# EAGLE design reLoaD_Motor (EAGLE 9.7.0)
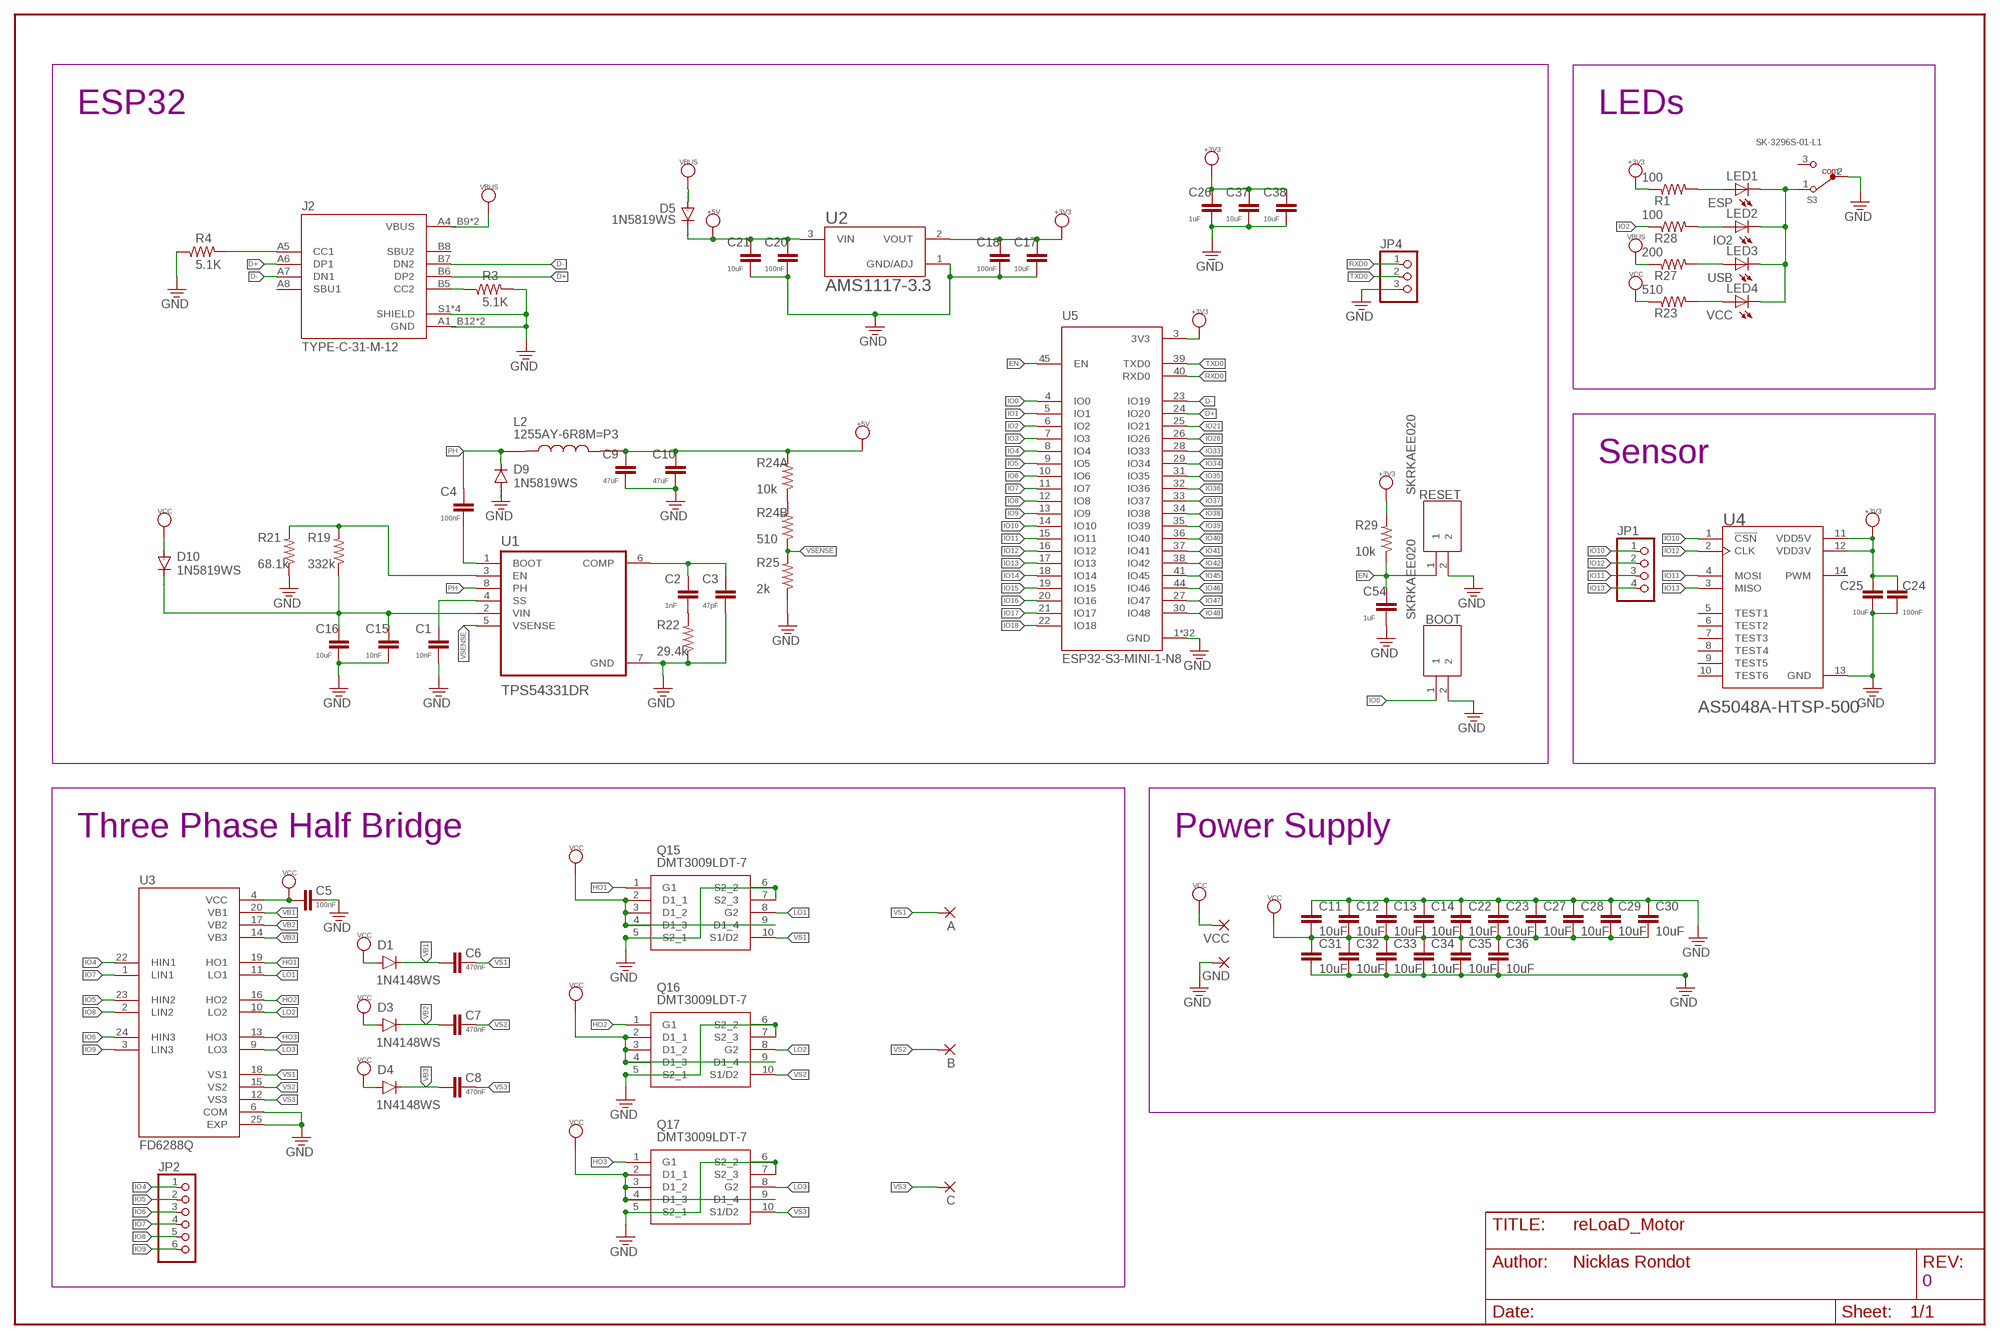
[diagram p0: schematic, sheet 1]

## Parts
A  3,81/1,4  [3,81/1,4]
B  3,81/1,4  [3,81/1,4]
BOOT  SKRKAEE020  [SKRKAEE020]
C  3,81/1,4  [3,81/1,4]
C1  10nF  C-EUC0603K  [C0603K]
C2  1nF  C-EUC0603K  [C0603K]
C3  47pF  C-EUC0603K  [C0603K]
C4  100nF  C-EUC0603K  [C0603K]
C5  100nF  C-EUC0603K  [C0603K]
C6  470nF  C-EUC0603K  [C0603K]
C7  470nF  C-EUC0603K  [C0603K]
C8  470nF  C-EUC0603K  [C0603K]
C9  47uF  C-EUC0603K  [C0603K]
C10  47uF  C-EUC0603K  [C0603K]
C11  10uF  C-EUC0805K  [C0805K]
C12  10uF  C-EUC0805K  [C0805K]
C13  10uF  C-EUC0805K  [C0805K]
C14  10uF  C-EUC0805K  [C0805K]
C15  10nF  C-EUC0603K  [C0603K]
C16  10uF  C-EUC0603K  [C0603K]
C17  10uF  C-EUC0603K  [C0603K]
C18  100nF  C-EUC0603K  [C0603K]
C20  100nF  C-EUC0603K  [C0603K]
C21  10uF  C-EUC0603K  [C0603K]
C22  10uF  C-EUC0805K  [C0805K]
C23  10uF  C-EUC0805K  [C0805K]
C24  100nF  C-EUC0603K  [C0603K]
C25  10uF  C-EUC0603K  [C0603K]
C26  1uF  C-EUC0603K  [C0603K]
C27  10uF  C-EUC0805K  [C0805K]
C28  10uF  C-EUC0805K  [C0805K]
C29  10uF  C-EUC0805K  [C0805K]
C30  10uF  C-EUC0805K  [C0805K]
C31  10uF  C-EUC0805K  [C0805K]
C32  10uF  C-EUC0805K  [C0805K]
C33  10uF  C-EUC0805K  [C0805K]
C34  10uF  C-EUC0805K  [C0805K]
C35  10uF  C-EUC0805K  [C0805K]
C36  10uF  C-EUC0805K  [C0805K]
C37  10uF  C-EUC0603K  [C0603K]
C38  10uF  C-EUC0603K  [C0603K]
C54  1uF  C-EUC0603K  [C0603K]
D1  1N4148WS  [SOD-323]
D3  1N4148WS  [SOD-323]
D4  1N4148WS  [SOD-323]
D5  1N5819WS  DIODE-SOD323-W  [SOD323-W]
D9  1N5819WS  DIODE-SOD323-W  [SOD323-W]
D10  1N5819WS  DIODE-SOD323-W  [SOD323-W]
GND  3,81/1,4  [3,81/1,4]
J2  TYPE-C-31-M-12  [HRO_TYPE-C-31-M-12]
JP1  PINHD-1X4  [1X04]
JP2  PINHD-1X6  [1X06]
JP4  PINHD-1X3  [1X03]
L2  1255AY-6R8M=P3  [IND_1255AY-6R8M=P3]
LED1  ESP  LEDCHIPLED_0805  [CHIPLED_0805]
LED2  IO2  LEDCHIPLED_0805  [CHIPLED_0805]
LED3  USB  LEDCHIPLED_0805  [CHIPLED_0805]
LED4  VCC  LEDCHIPLED_0805  [CHIPLED_0805]
Q15  DMT3009LDT-7  [DMT3009LDT7]
Q16  DMT3009LDT-7  [DMT3009LDT7]
Q17  DMT3009LDT-7  [DMT3009LDT7]
R1  100  R-US_R0603  [R0603]
R3  5.1K  R-US_R0603  [R0603]
R4  5.1K  R-US_R0603  [R0603]
R19  332k  R-US_R0603  [R0603]
R21  68.1k  R-US_R0603  [R0603]
R22  29.4k  R-US_R0603  [R0603]
R23  510  R-US_R0603  [R0603]
R24A  10k  R-US_R0603  [R0603]
R24B  510  R-US_R0603  [R0603]
R25  2k  R-US_R0603  [R0603]
R27  200  R-US_R0603  [R0603]
R28  100  R-US_R0603  [R0603]
R29  10k  R-US_R0603  [R0603]
RESET  SKRKAEE020  [SKRKAEE020]
S3  SK-3296S-01-L1  450404015514  [450404015514]
U1  TPS54331DR  [SOIC127P599X175-8N]
U2  AMS1117-3.3  [SOT229P700X180-4N]
U3  FD6288Q  [QFN50P400X400X90-25N]
U4  AS5048A-HTSP-500  [SOP65P640X120-14N]
U5  ESP32-S3-MINI-1-N8  [XCVR_ESP32-S3-MINI-1-N8]
VCC  3,81/1,4  [3,81/1,4]

## Nets
+3V3: C17.1 C18.1 C24.2 C25.2 C26.1 C37.1 C38.1 R1.1 R29.2 U2.2(VOUT) U4.11(VDD5V) U4.12(VDD3V) U5.3(3V3)
+5V: C9.1 C10.1 C20.1 C21.1 D5.C L2.2 R24A.2 U2.3(VIN)
D+: J2.A6(DP1) J2.B6(DP2) U5.24(IO20)
D-: J2.A7(DN1) J2.B7(DN2) U5.23(IO19)
EN: C54.1 R29.1 RESET.1 U5.45(EN)
GND: BOOT.2 C1.2 C3.2 C5.1 C9.2 C10.2 C11.1 C12.1 C13.1 C14.1 C15.2 C16.2 C17.2 C18.2 C20.2 C21.2 C22.1 C23.1 C24.1 C25.1 C26.2 C27.1 C28.1 C29.1 C30.1 C31.2 C32.2 C33.2 C34.2 C35.2 C36.2 C37.2 C38.2 C54.2 D9.A GND.1(P) J2.A1_B12(GND) J2.B1_A12(GND) J2.S1(SHIELD) J2.S2(SHIELD) J2.S3(SHIELD) J2.S4(SHIELD) JP4.3 Q15.5(S2_1) Q15.6(S2_2) Q15.7(S2_3) Q16.5(S2_1) Q16.6(S2_2) Q16.7(S2_3) Q17.5(S2_1) Q17.6(S2_2) Q17.7(S2_3) R3.2 R4.1 R21.1 R22.1 R25.1 RESET.2 S3.2 U1.7(GND) U2.1(GND/ADJ) U3.6(COM) U3.25(EXP) U4.13(GND) U5.1(GND) U5.2(GND) U5.42(GND) U5.43(GND) U5.46(GND) U5.47(GND) U5.48(GND) U5.49(GND) U5.50(GND) U5.51(GND) U5.52(GND) U5.53(GND) U5.54(GND) U5.55(GND) U5.56(GND) U5.57(GND) U5.58(GND) U5.59(GND) U5.60(GND) U5.61(GND) U5.61_1(GND) U5.61_2(GND) U5.61_3(GND) U5.61_4(GND) U5.61_5(GND) U5.61_6(GND) U5.61_7(GND) U5.61_8(GND) U5.62(GND) U5.63(GND) U5.64(GND) U5.65(GND)
HO1: Q15.1(G1) U3.19(HO1)
HO2: Q16.1(G1) U3.16(HO2)
HO3: Q17.1(G1) U3.13(HO3)
IO0: BOOT.1 U5.4(IO0)
IO1: U5.5(IO1)
IO2: R28.1 U5.6(IO2)
IO3: U5.7(IO3)
IO4: JP2.1 U3.22(HIN1) U5.8(IO4)
IO5: JP2.2 U3.23(HIN2) U5.9(IO5)
IO6: JP2.3 U3.24(HIN3) U5.10(IO6)
IO7: JP2.4 U3.1(LIN1) U5.11(IO7)
IO8: JP2.5 U3.2(LIN2) U5.12(IO8)
IO9: JP2.6 U3.3(LIN3) U5.13(IO9)
IO10: JP1.1 U4.1(!CSN) U5.14(IO10)
IO11: JP1.3 U4.4(MOSI) U5.15(IO11)
IO12: JP1.2 U4.2(CLK) U5.16(IO12)
IO13: JP1.4 U4.3(MISO) U5.17(IO13)
IO14: U5.18(IO14)
IO15: U5.19(IO15)
IO16: U5.20(IO16)
IO17: U5.21(IO17)
IO18: U5.22(IO18)
IO21: U5.25(IO21)
IO26: U5.26(IO26)
IO33: U5.28(IO33)
IO34: U5.29(IO34)
IO35: U5.31(IO35)
IO36: U5.32(IO36)
IO37: U5.33(IO37)
IO38: U5.34(IO38)
IO39: U5.35(IO39)
IO40: U5.36(IO40)
IO41: U5.37(IO41)
IO42: U5.38(IO42)
IO45: U5.41(IO45)
IO46: U5.44(IO46)
IO47: U5.27(IO47)
IO48: U5.30(IO48)
LO1: Q15.8(G2) U3.11(LO1)
LO2: Q16.8(G2) U3.10(LO2)
LO3: Q17.8(G2) U3.9(LO3)
N$1: LED3.A R27.2
N$2: LED4.A R23.2
N$3: LED1.A R1.2
N$4: J2.B5(CC2) R3.1
N$5: LED1.C LED2.C LED3.C LED4.C S3.1
N$6: LED2.A R28.2
N$7: R19.2 R21.2 U1.3(EN)
N$8: C1.1 U1.4(SS)
N$9: R24A.1 R24B.2
N$10: C2.1 C3.1 U1.6(COMP)
N$11: C2.2 R22.2
N$30: C4.2 U1.1(BOOT)
N$35: C15.1 C16.1 D10.C R19.1 U1.2(VIN)
N$80: J2.A5(CC1) R4.2
PH: C4.1 D9.C L2.1 U1.8(PH)
RXD0: JP4.1 U5.40(RXD0)
TXD0: JP4.2 U5.39(TXD0)
VB1: C6.1 D1.C U3.20(VB1)
VB2: C7.1 D3.C U3.17(VB2)
VB3: C8.1 D4.C U3.14(VB3)
VBUS: D5.A J2.A4_B9(VBUS) J2.B4_A9(VBUS) R27.1
VCC: C5.2 C11.2 C12.2 C13.2 C14.2 C22.2 C23.2 C27.2 C28.2 C29.2 C30.2 C31.1 C32.1 C33.1 C34.1 C35.1 C36.1 D1.A D3.A D4.A D10.A Q15.2(D1_1) Q15.3(D1_2) Q15.4(D1_3) Q15.9(D1_4) Q16.2(D1_1) Q16.3(D1_2) Q16.4(D1_3) Q16.9(D1_4) Q17.2(D1_1) Q17.3(D1_2) Q17.4(D1_3) Q17.9(D1_4) R23.1 U3.4(VCC) VCC.1(P)
VS1: A.1(P) C6.2 Q15.10(S1/D2) U3.18(VS1)
VS2: B.1(P) C7.2 Q16.10(S1/D2) U3.15(VS2)
VS3: C8.2 C.1(P) Q17.10(S1/D2) U3.12(VS3)
VSENSE: R24B.1 R25.2 U1.5(VSENSE)
Unconnected: J2.A8(SBU1) J2.B8(SBU2) S3.3 U4.5(TEST1) U4.6(TEST2) U4.7(TEST3) U4.8(TEST4) U4.9(TEST5) U4.10(TEST6) U4.14(PWM)

## Notes on the sheet
- ESP32 | LEDs
- Sensor
- Three Phase Half Bridge | Power Supply
- 0

## Library data of the parts
A B C GND VCC = wirepad:3,81/1,4: THROUGH-HOLE PAD
BOOT RESET = SKRKAEE020:SKRKAEE020: Tactile Switches 3.9x2.9x2.0mm 160gf Packaging Temp 80oC Source: Datasheet; DESCRIPTION: Tactile Switches 3.9x2.9x2.0mm 160gf Packaging Temp 80oC; HEIGHT: 2mm; MANUFACTURER_NAME: ALPS Electric; MANUFACTURER_PART_NUMBER: SKRKAEE020; MOUSER_PART_NUMBER: 688-SKRKAEE020; MOUSER_PRICE-STOCK: https://www.mouser.co.uk/ProductDetail/Alps-Alpine/SKRKAEE020?qs=MrosSN5%252BUQW89XjXIp8Ugw%3D%3D
C1-C10 C15-C18 C20 C21 C24-C26 C37 C38 C54 = resistor:C-EU: CAPACITOR, European symbol
C11-C14 C22 C23 C27-C36 = rcl:C-EU: CAPACITOR, European symbol; SPICEPREFIX: C
D1 D3 D4 = Diodes-2:1N4148WS: DIODE GEN PURP 75V 150MA SOD323F Manufacturer's datasheet; CREATED_BY: PCBLayout.com; DIGIKEY_PART_NUMBER: 1N4148WSFSTR-ND; MANUFACTURER: Diodes Incorporated; MPN: 1N4148WS; PACKAGE: SOD-323
D5 D9 D10 = diode:DIODE-: DIODE
J2 = TYPE-C-31-M-12:TYPE-C-31-M-12: Check availability; AVAILABILITY: Not in stock; DESCRIPTION: USB Connectors 24 Receptacle 1 8.94*7.3mm RoHS; MF: HRO Electronics Co., Ltd.; MP: TYPE-C-31-M-12; PACKAGE: Package; PRICE: None
JP1 = DC_LOAD_AU:PINHD-1X4: PIN HEADER
JP2 = pinhead:PINHD-1X6: PIN HEADER
JP4 = pinhead:PINHD-1X3: PIN HEADER
L2 = 1255AY-6R8M=P3:1255AY-6R8M=P3: 3.9µH Shielded Wirewound Inductor 4.2A 26.4mOhm Max Nonstandard Check availability; AVAILABILITY: Not in stock; CHECK_PRICES: https://www.snapeda.com/parts/1255AY-6R8M=P3/Murata+Electronics+North+America/view-part/?ref=eda; DESCRIPTION: 6.8 µH Shielded Drum Core, Wirewound Inductor 3.4 A 36mOhm Nonstandard; MF: Murata Electronics; MP: 1255AY-6R8M=P3; PACKAGE: NONSTANDARD; PRICE: None; PURCHASE-URL: https://www.snapeda.com/api/url_track_click_mouser/?unipart_id=1508412&manufacturer=Murata Electronics&part_name=1255AY-6R8M=P3&search_term=1255ay-6r8m=p3; SNAPEDA_LINK: https://www.snapeda.com/parts/1255AY-6R8M=P3/Murata+Electronics+North+America/view-part/?ref=snap
LED1-LED4 = adafruit:LED: LED OSRAM: - CHIPLED LG R971, LG N971, LY N971, LG Q971, LY Q971, LO R971, LY R971 LH N974, LH R974 LS Q976, LO Q976, LY Q976 LO Q996 - Hyper CHIPLED LW Q18S LB Q993, LB Q99A, LB R99A - SideLED LS A670, LO A670, LY A670, LG A670, LP A670 LB A673, LV A673, LT A673, LW A673 LH A674 LY A675 LS A676, LA A676, LO A676, LY A676, LW A676 LS A679, LY A679, LG A679 - Hyper Micro SIDELED® LS Y876, LA Y876, LO Y876, LY Y876 LT Y87S - SmartLED LW L88C, LW L88S LB L89C, LB L89S, LG L890 LS L89K, LO L89K, LY L89K LS L896, LA L896, LO L896, LY L896 - TOPLED LS T670, LO T670, LY T670, LG T670, LP T670 LSG T670, LSP T670, LSY T670, LOP T670, LYG T670 LG T671, LOG T671, LSG T671 LB T673, LV T673, LT T673, LW T673 LH T674 LS T676, LA T676, LO T676, LY T676, LB T676, LH T676, LSB T676, LW T676 LB T67C, LV T67C, LT T67C, LS T67K, LO T67K, LY T67K, LW E67C LS E67B, LA E67B, LO E67B, LY E67B, LB E67C, LV E67C, LT E67C LW T67C LS T679, LY T679, LG T679 LS T770, LO T770, LY T770, LG T770, LP T770 LB T773, LV T773, LT T773, LW T773 LH T774 LS E675, LA E675, LY E675, LS T675 LS T776, LA T776, LO T776, LY T776, LB T776 LHGB T686 LT T68C, LB T68C - Hyper Mini TOPLED® LB M676 - Mini TOPLED Santana® LG M470 LS M47K, LO M47K, LY M47K Source: http://www.osram.convergy.de/
Q15-Q17 = DMT3009LDT-7:DMT3009LDT-7: Trans MOSFET N-CH 30V 30A 8-Pin VDFN T/R Source: Datasheet; DESCRIPTION: Trans MOSFET N-CH 30V 30A 8-Pin VDFN T/R; HEIGHT: 0.85mm; MANUFACTURER_NAME: Diodes Incorporated; MANUFACTURER_PART_NUMBER: DMT3009LDT-7; MOUSER_PART_NUMBER: 621-DMT3009LDT-7; MOUSER_PRICE-STOCK: https://www.mouser.co.uk/ProductDetail/Diodes-Incorporated/DMT3009LDT-7?qs=60RJRzIpcl%2Fbs7PsZRGw9g%3D%3D
R1 R3 R4 R19 R21-R23 R24A R24B R25 R27-R29 = resistor:R-US_: RESISTOR, American symbol
S3 = Wurth_Switch_WS-SLSU:450404015514: WS-SLSU Mini Slide Switch, Same Side Connection Side Push 6.7x2.7 mm Properties Actuator Material:PA46 Actuator Flammability Rating:UL94 HB Actuator Color:Black Frame Material:LCP Frame Flammability Rating:UL94 V-0 Frame Color:Black Contact Material:Copper Alloy Contact Plating:Silver Terminal Material:Copper Alloy Terminal Plating:Silver Switching Function:On-On Schematic:SPDT Connection Type:Same Side Connection Qty.:3300 Material Properties Cover Material:Stainless Steel General Information Operating Temperature:-40 up to +85 °C Packaging Properties Packaging :Tape and Reel Details see: https://www.we-online.com/catalog/en/SLSU_6_7X_2_7_SMD_HORIZONTAL/ Updated by yingchun,Shan;2020-02-25 2020(C) Würth Elektronik; DATASHEET-URL: https://www.we-online.com/catalog/datasheet/450404015514.pdf; IR: 300mA; PACKAGING: Tape and Reel; PART-NUMBER: 450404015514; QTY: 150; VR: 5V(DC)
U1 = TPS54331DR:TPS54331DR: Check availability; AVAILABILITY: In Stock; CHECK_PRICES: https://www.snapeda.com/parts/TPS54331DR/Texas+Instruments/view-part/?ref=eda; DESCRIPTION: 3.5V to 28V Input, 3A, 570kHz Step-Down Converter with Eco-mode; MF: Texas Instruments; MP: TPS54331DR; PACKAGE: SOIC-8 Texas Instruments; PRICE: None; PURCHASE-URL: https://www.snapeda.com/api/url_track_click_mouser/?unipart_id=490779&manufacturer=Texas Instruments&part_name=TPS54331DR&search_term=tps54331dr; SNAPEDA_LINK: https://www.snapeda.com/parts/TPS54331DR/Texas+Instruments/view-part/?ref=snap
U2 = AMS1117-3.3:AMS1117-3.3: Check availability; AVAILABILITY: Not in stock; CHECK_PRICES: https://www.snapeda.com/parts/AMS1117-3.3/Advanced+Monolithic+Systems/view-part/?ref=eda; DESCRIPTION: Sot223/Pkg 1-Amp 3.3-Volt Low Drop Out Voltage Regulatator; MF: Advanced Monolithic Systems; MP: AMS1117-3.3; PACKAGE: SOT-223 Seeed Technology; PRICE: None; SNAPEDA_LINK: https://www.snapeda.com/parts/AMS1117-3.3/Advanced+Monolithic+Systems/view-part/?ref=snap
U3 = FD6288Q:FD6288Q: MOS Drivers QFN-24 Check availability; AVAILABILITY: Not in stock; CHECK_PRICES: https://www.snapeda.com/parts/FD6288Q/Fortior+Tech/view-part/?ref=eda; DESCRIPTION: MOS Drivers QFN-24; MF: Fortior Tech; MP: FD6288Q; PACKAGE: Package; PRICE: None; SNAPEDA_LINK: https://www.snapeda.com/parts/FD6288Q/Fortior+Tech/view-part/?ref=snap
U4 = AS5048A-HTSP-500:AS5048A-HTSP-500: AS5048B Series 360° 3.3 / 5 V 14 bit Magnetic Rotary Encoder - TSSOP-14 Check availability; AVAILABILITY: In Stock; CHECK_PRICES: https://www.snapeda.com/parts/AS5048A-HTSP-500/ams/view-part/?ref=eda; DESCRIPTION: Hall Effect Sensor Angle External Magnet, Not Included Gull Wing; MF: ams; MP: AS5048A-HTSP-500; PACKAGE: TSSOP-14 ams; PRICE: None; PURCHASE-URL: https://www.snapeda.com/api/url_track_click_mouser/?unipart_id=58079&manufacturer=ams&part_name=AS5048A-HTSP-500&search_term=as5048a-htsp-500; SNAPEDA_LINK: https://www.snapeda.com/parts/AS5048A-HTSP-500/ams/view-part/?ref=snap
U5 = ESP32-S3-MINI-1-N8:ESP32-S3-MINI-1-N8: Bluetooth, WiFi 802.11b/g/n, Bluetooth v5.0 Transceiver Module 2.4GHz PCB Trace Surface Mount Check availability; AVAILABILITY: In Stock; CHECK_PRICES: https://www.snapeda.com/parts/ESP32-S3-MINI-1-N8/Espressif+Systems/view-part/?ref=eda; DESCRIPTION: Bluetooth, WiFi 802.11b/g/n, Bluetooth v5.0 Transceiver Module 2.4GHz PCB Trace Surface Mount; MF: Espressif Systems; MP: ESP32-S3-MINI-1-N8; PACKAGE: None; PRICE: None; PURCHASE-URL: https://www.snapeda.com/api/url_track_click_mouser/?unipart_id=8941370&manufacturer=Espressif Systems&part_name=ESP32-S3-MINI-1-N8&search_term= esp32-s3-mini-1-n8; SNAPEDA_LINK: https://www.snapeda.com/parts/ESP32-S3-MINI-1-N8/Espressif+Systems/view-part/?ref=snap

## Board
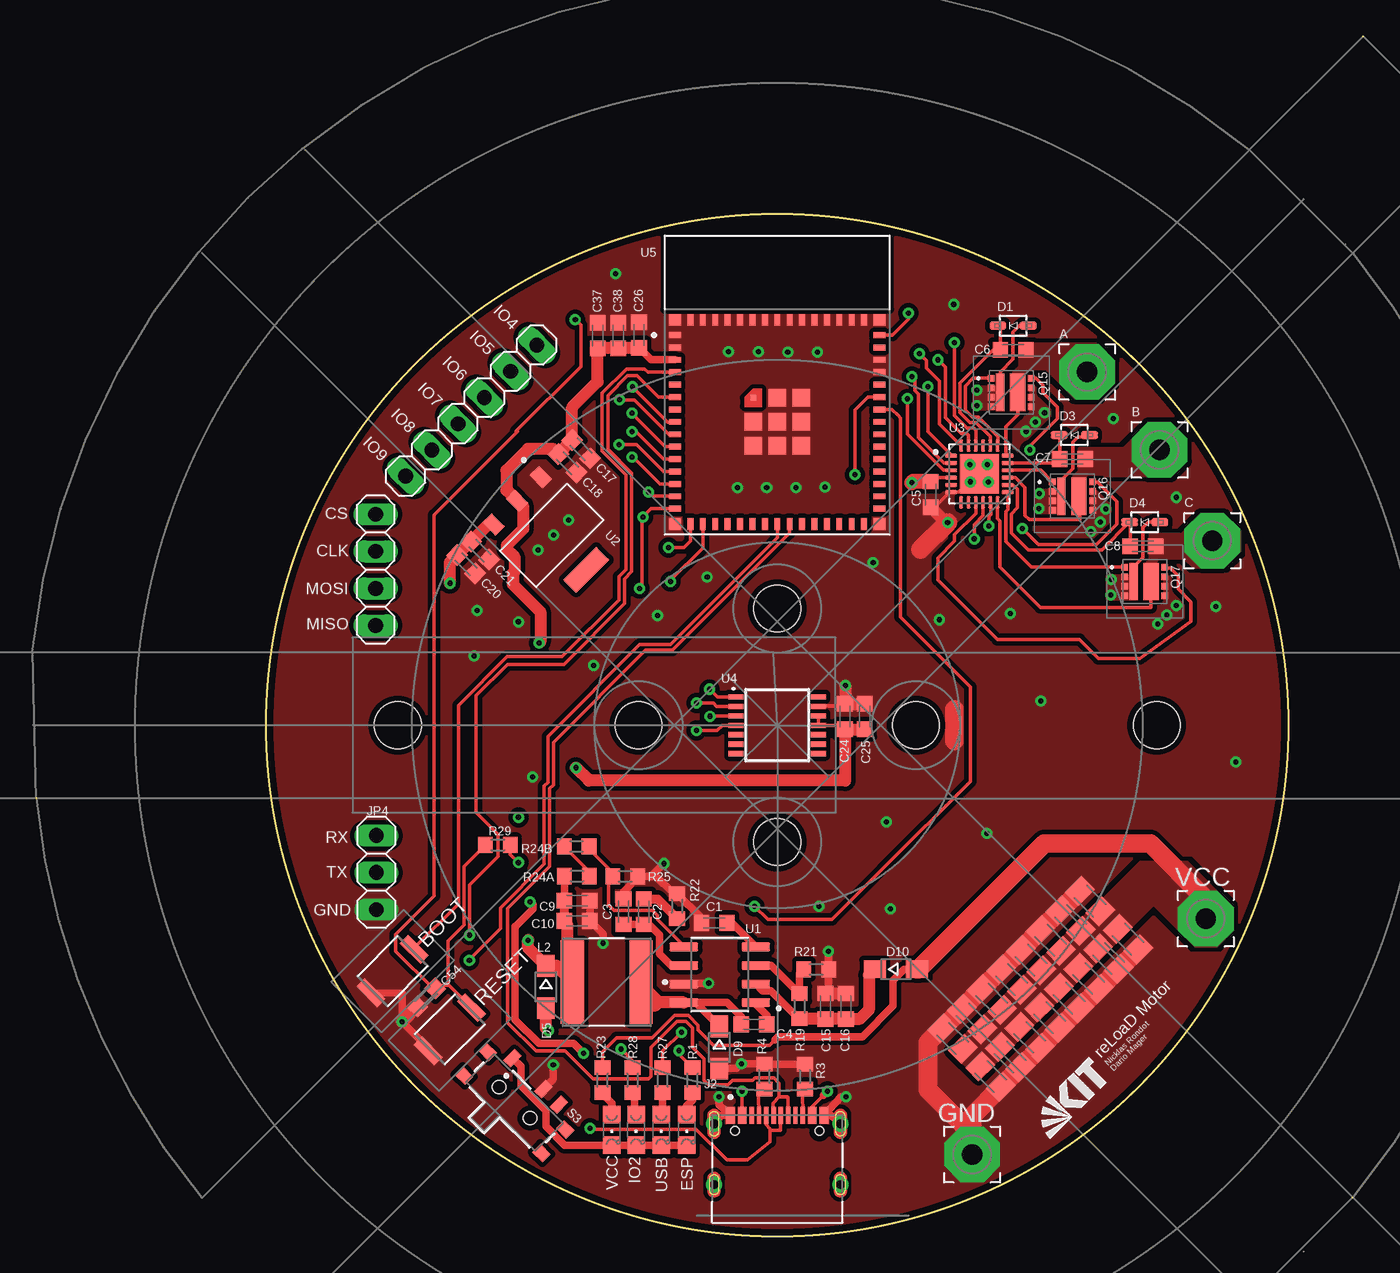
[diagram p1: board, top side]
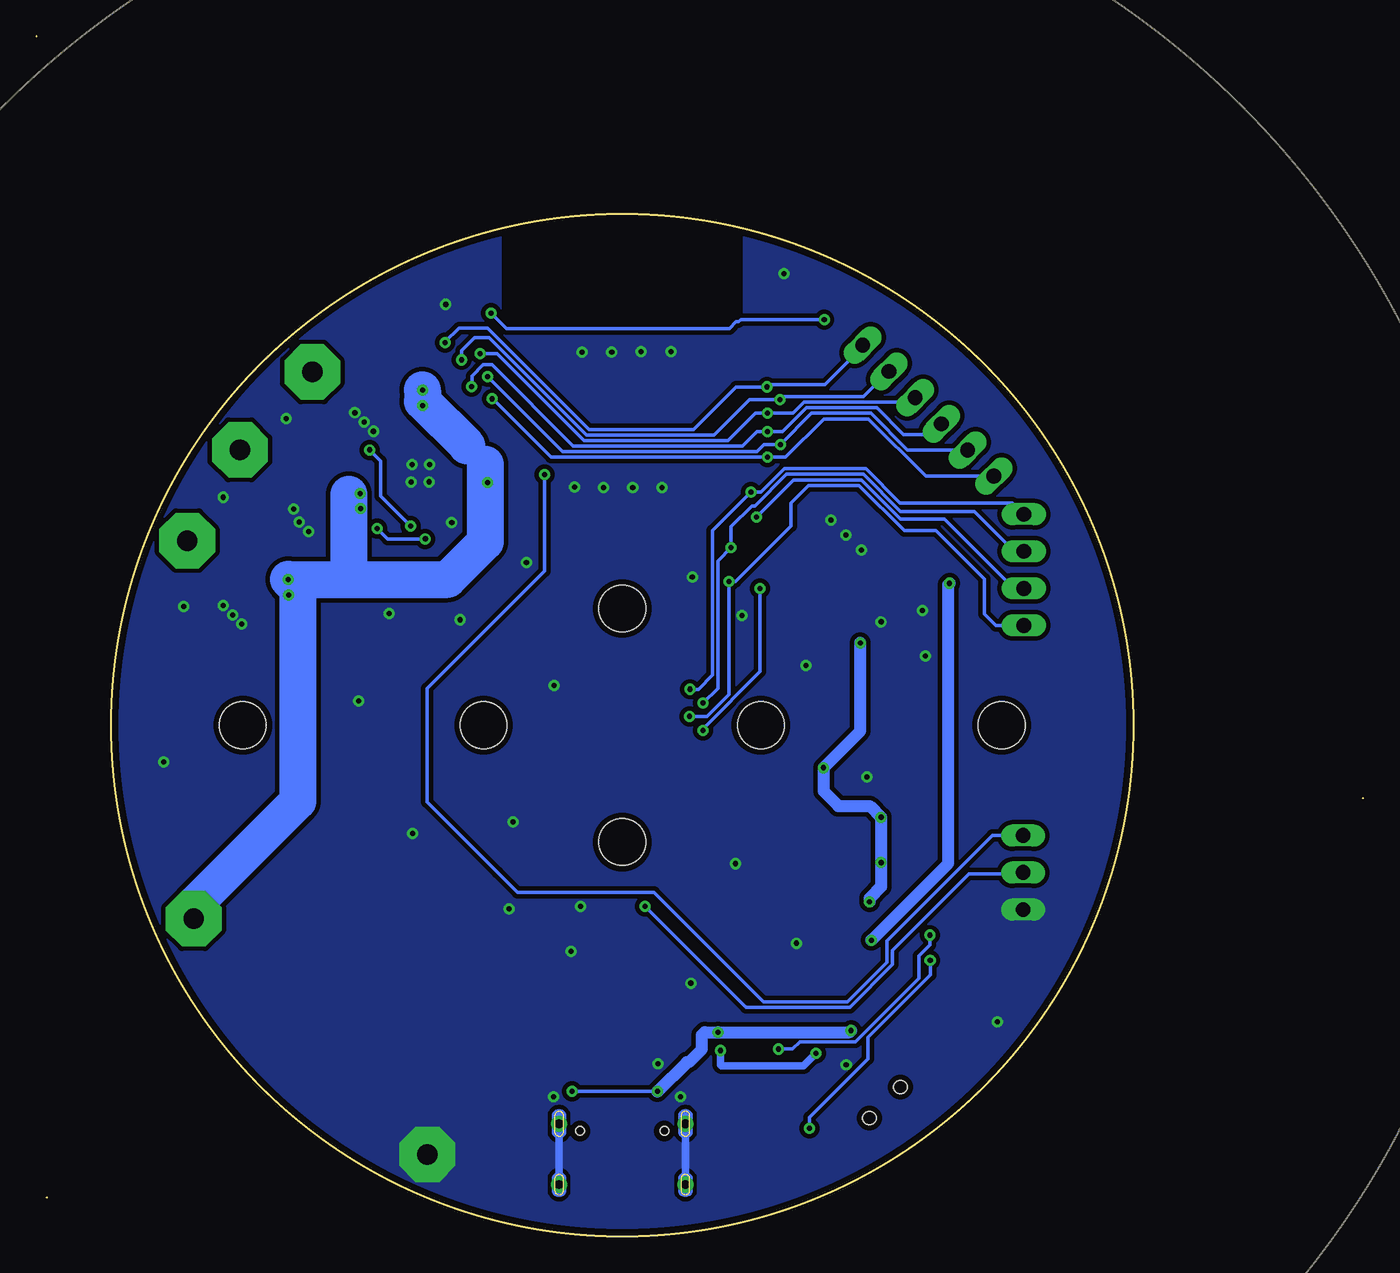
[diagram p2: board, bottom side, seen from below]

Size 90.89 x 82.2 mm. Coordinates in mm from the lower left corner, seen from the top.
Outline: 90.19,2.64 90.19,2.64
Outline: 90.88,82.2 90.89,82.2
Outline: 0,30 0,30
Outline: circle at 50.76,35 radius 35
Copper layers (1*16): Top 0.035mm / dielectric 1.5mm / Bottom 0.035mm
Design rules "Fusion Electronics Design Rules": minimum track width 6mil, minimum drill 0.35mm, track to track 5mil, track to pad 5mil, pad to pad 5mil, via to via 0.5mm, smd to smd 5mil, copper to edge 0.4mm, drill to drill 0.5mm, minimum pad ring 10mil, minimum via ring 8mil, stop-mask expansion 4mil, vias tented up to drill 0mil, thermal gap 10mil
Holes 3.2 mm at 41.26,35 60.26,35 50.76,43 50.76,27 24.76,35 76.76,35
bRestrict: area 42.9,62.9 to 58.6,68.8

### Footprints (pad centres in the part's own frame; a part is rotated, then mirrored left to right if it is on the bottom)
3,81/1,4 = drill 1.397 pad 3.81 octagon: 1 0,0
SKRKAEE020 = smd 0.8 x 2: 1 -2.1,0; 2 2.1,0
C0603K = smd 1.05 x 1.08: 1 -0.875,0; 2 0.875,0
C0805K = smd 1.3 x 1.6: 1 -1,0; 2 1,0
SOD-323 = smd 1.14 x 0.52: A 1.04,0; C -1.04,0
SOD323-W = smd 1.5 x 1.2: A 1.45,0; C -1.45,0
HRO_TYPE-C-31-M-12 = smd 0.6 x 1.14: A1_B12 -3.2,4.75; A4_B9 -2.4,4.75; B1_A12 3.2,4.75; B4_A9 2.4,4.75 | smd 0.3 x 1.14: A5 -1.25,4.75; A6 -0.25,4.75; A7 0.25,4.75; A8 1.25,4.75; B5 1.75,4.75; B6 0.75,4.75; B7 -0.75,4.75; B8 -1.75,4.75 | drill 0.6 pad 0.9: S1 -4.325,4.17; S2 4.325,4.17; S3 -4.325,0; S4 4.325,0 | hole 0.6: -2.89,3.68; 2.89,3.68
1X04 = drill 1.016 long: 1 -3.81,0; 2 -1.27,0; 3 1.27,0; 4 3.81,0
1X06 = drill 1.016 long: 1 -6.35,0; 2 -3.81,0; 3 -1.27,0; 4 1.27,0; 5 3.81,0; 6 6.35,0
1X03 = drill 1.016 long: 1 -2.54,0; 2 0,0; 3 2.54,0
IND_1255AY-6R8M=P3 = smd 1.6 x 5.7: 1 -2.35,0; 2 2.35,0
CHIPLED_0805 = smd 1.2 x 1.2: A 0,-1.05; C 0,1.05
DMT3009LDT7 = smd 0.45 x 0.45: 1 -0.975,-1.375; 2 -0.325,-1.375; 3 0.325,-1.375; 4 0.975,-1.375; 5 0.975,1.375; 6 0.325,1.375; 7 -0.325,1.375; 8 -0.975,1.375 | smd 2.55 x 0.566: 9 0,-0.761 | smd 2.55 x 1.044: 10 0,0.433
R0603 = smd 1 x 1.1: 1 -0.85,0; 2 0.85,0
450404015514 = smd 0.7 x 1.1: 1 2.25,-2.05; 2 -0.75,-2.05; 3 -2.25,-2.05 | smd 1 x 0.8: Z1 -3.75,1.15; Z2 3.75,1.15; Z3 3.75,-1.15; Z4 -3.75,-1.15 | hole 0.9: -1.5,0; 1.5,0
SOIC127P599X175-8N = smd 1.97 x 0.6: 1 -2.47,1.905; 2 -2.47,0.635; 3 -2.47,-0.635; 4 -2.47,-1.905; 5 2.47,-1.905; 6 2.47,-0.635; 7 2.47,0.635; 8 2.47,1.905
SOT229P700X180-4N = smd 1.31 x 0.93: 1 -3.345,2.29; 2 -3.345,0; 3 -3.345,-2.29 | smd 1.31 x 3.24: 4 3.345,0
QFN50P400X400X90-25N = smd 0.83 x 0.27: 1 -1.94,1.25; 2 -1.94,0.75; 3 -1.94,0.25; 4 -1.94,-0.25; 5 -1.94,-0.75; 6 -1.94,-1.25; 13 1.94,-1.25; 14 1.94,-0.75; 15 1.94,-0.25; 16 1.94,0.25; 17 1.94,0.75; 18 1.94,1.25 | smd 0.27 x 0.83: 7 -1.25,-1.94; 8 -0.75,-1.94; 9 -0.25,-1.94; 10 0.25,-1.94; 11 0.75,-1.94; 12 1.25,-1.94; 19 1.25,1.94; 20 0.75,1.94; 21 0.25,1.94; 22 -0.25,1.94; 23 -0.75,1.94; 24 -1.25,1.94 | smd 2.7 x 2.7: 25 0,0
SOP65P640X120-14N = smd 1 x 0.35: 1 -2.825,1.95; 2 -2.825,1.3; 3 -2.825,0.65; 4 -2.825,0; 5 -2.825,-0.65; 6 -2.825,-1.3; 7 -2.825,-1.95; 8 2.825,-1.95; 9 2.825,-1.3; 10 2.825,-0.65; 11 2.825,0; 12 2.825,0.65; 13 2.825,1.3; 14 2.825,1.95
XCVR_ESP32-S3-MINI-1-N8 = smd 0.8 x 0.4: 1 -7,5.95; 2 -7,5.1; 3 -7,4.25; 4 -7,3.4; 5 -7,2.55; 6 -7,1.7; 7 -7,0.85; 8 -7,0; 9 -7,-0.85; 10 -7,-1.7; 11 -7,-2.55; 12 -7,-3.4; 13 -7,-4.25; 14 -7,-5.1; 15 -7,-5.95; 31 7,-5.95; 32 7,-5.1; 33 7,-4.25; 34 7,-3.4; 35 7,-2.55; 36 7,-1.7; 37 7,-0.85; 38 7,0; 39 7,0.85; 40 7,1.7; 41 7,2.55; 42 7,3.4; 43 7,4.25; 44 7,5.1; 45 7,5.95 | smd 0.4 x 0.8: 16 -5.95,-7; 17 -5.1,-7; 18 -4.25,-7; 19 -3.4,-7; 20 -2.55,-7; 21 -1.7,-7; 22 -0.85,-7; 23 0,-7; 24 0.85,-7; 25 1.7,-7; 26 2.55,-7; 27 3.4,-7; 28 4.25,-7; 29 5.1,-7; 30 5.95,-7; 46 5.95,7; 47 5.1,7; 48 4.25,7; 49 3.4,7; 50 2.55,7; 51 1.7,7; 52 0.85,7; 53 0,7; 54 -0.85,7; 55 -1.7,7; 56 -2.55,7; 57 -3.4,7; 58 -4.25,7; 59 -5.1,7; 60 -5.95,7 | smd 1.2 x 1.2: 61 0,0; 61_2 0,1.65; 61_3 1.65,1.65; 61_4 1.65,0; 61_5 1.65,-1.65; 61_6 0,-1.65; 61_7 -1.65,-1.65; 61_8 -1.65,0 | smd 0.4 x 0.4: 61_1 -1.65,1.65 | smd 0.8 x 0.8: 62 -7,7; 63 -7,-7; 64 7,-7; 65 7,7

### Placement (x,y rotation side)
A  72,59.21 0 top
B  76.95,53.87 0 top
BOOT  24.4,18.16 225 top
C  80.57,47.65 0 top
C1  46.44,21.47 180 top
C2  41.62,22.23 90 top
C3  40.22,22.23 90 top
C4  49.17,14.51 0 top
C5  61.26,50.82 90 top
C6  66.92,60.73 0 top
C7  70.98,53.24 0 top
C8  75.81,47.27 0 top
C9  37.04,22.99 0 top
C10  37.04,21.59 0 top
C11  65.37,10.92 135 top
C12  72.19,22.96 315 top
C13  74.8,20.35 135 top
C14  70.85,21.61 315 top
C15  54.06,15.75 90 top
C16  55.46,15.75 90 top
C17  37.32,53.91 315 top
C18  36.38,52.95 315 top
C20  29.44,46.03 315 top
C21  30.39,46.96 315 top
C22  73.45,19 135 top
C23  69.5,20.26 315 top
C24  55.39,35.6 270 top
C25  56.75,35.6 270 top
C26  41.29,61.74 90 top
C27  72.1,17.66 135 top
C28  68.15,18.91 315 top
C29  70.76,16.31 135 top
C30  66.81,17.57 315 top
C31  69.41,14.96 315 top
C32  65.46,16.22 135 top
C33  68.06,13.62 315 top
C34  64.11,14.87 135 top
C35  66.72,12.27 315 top
C36  62.77,13.53 135 top
C37  38.46,61.71 90 top
C38  39.86,61.71 90 top
C54  26.71,16.34 225 top
D1  66.92,62.38 0 top
D3  71.11,54.89 0 top
D4  75.94,48.92 0 top
D5  34.91,17.07 270 top
D9  46.79,12.93 270 top
D10  58.89,18.29 0 top
GND  64.11,5.59 0 top
J2  50.76,3.53 0 top
JP1  23.24,45.65 270 top
JP2  29.79,56.56 225 top
JP4  23.29,24.91 270 top
L2  39.08,17.4 180 top
LED1  44.55,7.28 180 top
LED2  41.09,7.28 180 top
LED3  42.81,7.28 180 top
LED4  39.42,7.28 180 top
Q15  66.79,57.81 270 top
Q16  70.98,50.7 270 top
Q17  75.94,44.86 270 top
R1  44.94,10.69 270 top
R3  52.66,10.93 90 top
R4  49.87,10.93 270 top
R19  52.28,15.75 90 top
R21  53.43,18.28 180 top
R22  43.9,22.61 270 top
R23  38.78,10.69 270 top
R24A  37.03,24.66 180 top
R24B  37.01,26.7 180 top
R25  40.35,24.64 180 top
R27  42.9,10.69 270 top
R28  40.85,10.69 270 top
R29  31.61,26.79 0 top
RESET  28.32,14.17 225 top
S3  32.76,9.15 135 top
U1  46.82,17.91 180 top
U2  35.3,48.01 315 top
U3  64.61,52.22 0 top
U4  50.76,35 0 top
U5  50.76,55.79 0 top
VCC  80.13,21.75 0 top

### Tracks (layer width: path | path; a pad name or v marks a point on that pad's centre or on a via)
+3V3  (via drill 0.35)
  Top 0.254: C24.2 55.11,35 U4.11 U4.12 | v44.03,12.71 44.03,12.45 R1.1 | R29.2 32.46,26.15 v33.02,25.59
  Top 0.508: 37.47,12.57 v37.47,12.53 36.81,13.19 34.43,13.19 32.8,14.83 32.8,21.23 32.82,21.23 34.02,22.43 34.02,22.71 v33.82,22.91 | U5.3 42.11,60.04 C26.1
  Top 0.813: C25.2 C24.2 55.41,34.7 55.41,31.21 37.85,31.21 v36.97,32.09 | C26.1 39.89,60.86 C38.1 C37.1 38.46,58.54 36.7,56.79 C17.1 35.76,53.59 C18.1 35.39,53.94 33.68,53.94 32.21,52.47 32.21,51.11 U2.2 33.35,49.97 33.35,48.45 32.22,47.32 32.22,47.09 32.76,46.55 32.76,45.51 32.65,45.4 32.65,44.66 34.54,42.77 34.54,40.74 v34.44,40.64
  Bottom 0.508: v37.47,12.53 38.36,11.65 43.95,11.65 44.03,11.73 v44.03,12.71
  Bottom 0.813: v34.44,40.64 34.44,34.62 v36.97,32.09 36.97,30.49 35.95,29.47 33.79,29.47 v33.02,28.7 v33.02,25.59 33.02,23.95 33.82,23.15 v33.82,22.91
+5V  (via drill 0.35)
  Top 0.508: C9.1 R24A.2
  Top 0.61: C10.1 C9.1
  Top 0.813: C10.1 36.34,21.42 36.34,17.88 36.73,17.49 L2.2 35.61,18.52 D5.C 33.69,19.74 v33.69,20.27 | v28.33,44.73 28.33,46.15 C20.1 29.75,47.58 C21.1 30.95,48.76 U2.3
  Bottom 0.813: v33.69,20.27 28.42,25.54 28.42,44.64 v28.33,44.73
D+
  Top 0.254: 50.89,9.53 50.46,9.11 50.46,8.29 J2.A6 | 50.89,9.53 51.46,9.53 51.48,9.51 J2.B6 | 50.89,9.53 50.89,10.47 50.53,10.83 49.22,10.83 49.06,10.67 47.69,10.67 47.4,10.38 46.03,10.38 45.74,10.66 45.74,12.14 44.95,12.94 44.95,14.28 44.5,14.73 43.87,14.73 42.09,12.95 42.09,10.93 41.94,10.78 38.13,10.78 36.22,12.69 34.22,12.69 32.29,14.62 32.29,22.46 35.17,25.34 35.17,30.68 35.42,30.93 35.42,33.83 41.74,40.15 43.6,40.15 51.61,48.16 U5.24
D-  (via drill 0.35)
  Top 0.254: 50.26,7.36 50.26,6.44 48.73,5.21 47.3,5.21 45.2,7.31 38.01,7.31 v37.94,7.38 | 50.26,7.36 50.38,7.24 50.96,7.24 | 50.96,7.24 | J2.A7 50.98,7.26 50.96,7.24 | J2.B7 49.98,7.64 50.26,7.36 | v29.66,18.89 29.66,18.93 31.8,21.07 31.8,22.5 34.79,25.49 34.79,30.84 35.04,31.09 35.04,34.25 41.32,40.53 43.44,40.53 50.76,47.85 U5.23
  Bottom 0.254: v37.94,7.38 37.94,8.14 33.94,12.14 33.94,13.61 29.66,17.89 v29.66,18.89
EN  (via drill 0.35)
  Top 0.254: 32.87,55.01 32.97,55.11 | 32.87,55.01 32.87,55.15 37.3,59.58 37.3,62.42 v36.92,62.8 | v59.76,63.25 59.76,62.84 58.66,61.74 U5.45 | 32.87,55.01 27.25,49.4 27.25,23.31 24.61,20.66 24.61,19.52 27.17,16.96 C54.1 27.55,17.18 28.27,17.18 RESET.1 28.2,17.26 28.2,20.21 29.3,21.31 29.3,25.33 R29.1
  Bottom 0.254: v36.92,62.8 42.63,62.8 42.78,62.65 42.95,62.65 43.42,62.19 58.7,62.19 v59.76,63.25
GND  (via drill 0.35)
  Top 0.254: C5.1 61.57,49.95 62.6,50.97 U3.6 63.17,50.97 63.88,51.68 v64,51.68 | U4.13 53.61,36.33 55.24,36.33 C24.1
  Top 0.508: R3.2 R4.1 49.83,11.81 v48.31,11.81 47.97,11.48 D9.A | J2.S1 46.94,8.28 J2.A1_B12 46.77,8.99 v46.77,9.54 | J2.S2 54.43,8.28 J2.B1_A12 55.13,9.53 v55.46,9.53 | v35.41,11.74 35.41,10.74 S3.2 | RESET.2 26.8,12.93 v25.05,14.68 v25.05,14.69 25.05,16.62 BOOT.2 | C9.2 C10.2 38.82,20.69 v38.82,20.07 | R25.1 42.47,24.64 43.58,23.53 43.83,23.53 R22.1 45.57,21.79 C1.2 45.57,21.61 | v42.99,25.52 42.11,24.64 R25.1 | C3.2 40.22,23.58 41.2,24.56 R25.1 | v46.06,17.33 44.41,17.33 U1.7 | C15.2 54.28,16.84 R21.1 v54.28,19.51 v54.27,19.52 | U3.25 64.54,52.22 v64,51.68 | U3.25 64.67,52.22 v65.22,51.67 | U3.25 64.61,52.3 v65.17,52.86
  Top 0.813: C54.2 v25.05,14.68 | C15.2 C16.2 | C25.1 C24.1 55.42,36.51 v55.42,37.72 | C5.1 62.31,48.9 v62.44,48.9
  Top 1.27: C13.1 C22.1 C27.1 C29.1 C31.2 C33.2 C35.2 C11.1 64.11,8.25 GND.1 64.11,6.98 61.09,10.01 61.09,13.26 C36.2 C34.2 C32.2 C30.1 C28.1 C23.1 C14.1 C12.1 | 62.89,33.91 62.89,36.09 | v62.44,48.9 60.58,47.04
  Bottom 0.508: J2.S1 J2.S3 | J2.S4 J2.S2
  other vias: 68.44,55.78 69.08,56.41 72.25,48.28 72.89,48.92 67.81,55.14 73.27,49.81 77.46,42.57 78.1,43.2 76.83,41.93 63.97,52.86 57.33,46.16 47.41,60.6 49.47,60.6 48.03,51.28 50.04,51.3 52.05,51.3 54.02,51.32 51.48,60.58 53.52,60.56 42.55,42.53 45.96,45.16 38.17,39.1 33.02,42.09 34,31.46 65.13,27.6 36.45,49.07 35.42,48.03 34.38,47.01 30.2,42.87 29.98,39.76 73.79,56.02 78.11,50.62 66.74,42.66 62.85,63.84 39.67,65.96 68.83,36.66 58.51,22.41 80.8,43.15 61.87,42.23 58.25,28.39 82.18,32.48 53.61,22.59
  pour Bottom (isolate 0.305, rank 2, no thermals): 47.83,-15.84 51.62,-15.92 55.4,-15.71 59.17,-15.22 62.88,-14.46 66.53,-13.42 70.09,-12.11 73.54,-10.55 76.86,-8.72 80.04,-6.66 83.06,-4.37 83.07,-4.36 83.07,-4.36 83.08,-4.35 83.09,-4.35 83.09,-4.35 90.12,2.68 90.12,2.68 90.13,2.69 92.36,5.62 94.38,8.7 96.16,11.92 97.71,15.27 99.01,18.71 100.06,22.24 100.86,25.84 101.39,29.48 101.65,33.16 101.65,36.84 101.39,40.51 100.86,44.16 100.06,47.76 99.01,51.29 97.71,54.73 96.16,58.07 94.37,61.29 92.36,64.38 90.12,67.3 90.12,67.31 90.12,67.32 90.11,67.32 90.11,67.33 83.07,74.37 80.05,76.67 76.87,78.73 73.54,80.56 70.08,82.13 66.52,83.44 62.87,84.48 59.16,85.25 55.4,85.73 51.61,85.94 47.81,85.86 44.04,85.5 40.3,84.87 36.62,83.95 33.01,82.76 29.51,81.31 26.12,79.6 22.87,77.65 19.77,75.46 16.85,73.04 14.11,70.41 11.57,67.59 9.26,64.58 7.17,61.42 5.33,58.1 3.73,54.66 2.4,51.1 1.34,47.46 0.55,43.75 0.03,39.99 0.03,30.08 0.04,30.07 0.04,30.07 0.05,30.07 0.05,30.06 0.06,30.06 0.07,30.05 0.07,30.05 0.07,30.04 0.08,30.03 0.08,30.02 0.08,30.02 0.08,30.01 0.59,26.26 1.38,22.55 2.45,18.91 3.78,15.36 5.37,11.92 7.21,8.6 9.3,5.43 11.61,2.43 14.14,-0.39 16.88,-3.02 19.8,-5.43 22.9,-7.62 26.15,-9.58 29.53,-11.29 33.03,-12.74 36.64,-13.93 40.32,-14.84 44.05,-15.48
  pour Top (no thermals): 68.13,56.45 68.12,56.41 67.5,55.8 67.5,55 67.69,54.82 67.94,54.82 69.37,56.24 69.37,56.52 69.14,56.74 68.62,56.74 68.58,56.76 68.29,57.05 68.27,57.09 68.27,58.16 68.13,58.16
  pour Top (no thermals): 72.3,49.35 72.29,49.31 71.92,48.95 71.92,48.16 72.14,47.95 72.33,47.95 73.24,48.85 73.24,49.3 73.26,49.34 73.54,49.62 73.54,49.92 73.37,50.08 72.57,50.08 72.53,50.1 72.48,50.15 72.46,50.19 72.46,51.08 72.3,51.08
  pour Top (isolate 0.305, rank 2, no thermals): 8.69,-2.2 90.87,-2.2 90.87,78.84 90.02,78.84 8.69,78.26
HO1
  Top 0.254: U3.19 65.86,54.26 65.87,54.27 65.87,54.79 64.53,56.13 64.11,56.13 63.65,56.59 63.65,58.26 64.18,58.78 Q15.1
HO2
  Top 0.254: Q16.1 68.81,52.47 U3.16
HO3
  Top 0.254: Q17.1 68.18,45.83 66.41,47.6 66.41,49.64 66.55,49.78 U3.13
IO0
  Top 0.254: U5.4 41.9,59.19 41.67,59.42 40.43,59.42 38.76,57.75 38.76,53.79 40.41,52.14 40.41,45.68 39.91,45.18 39.91,43.58 36.03,39.7 32.25,39.7 28.92,36.37 28.92,22.77 25.88,19.74 BOOT.1
IO2  (via drill 0.35)
  Top 0.254: 40.74,11.64 R28.1 | R28.1 40.85,11.86 | v40.05,12.81 40.85,12.01 R28.1 | v29.68,20.62 29.68,24.06 31.61,26 31.61,27.54 30.13,29.02 30.13,37.05 32.26,39.18 36.14,39.18 40.29,43.33 40.29,45.02 40.79,45.52 40.79,52.3 39.15,53.94 39.15,57.6 40.51,58.96 41.15,58.96 42.62,57.49 U5.6
  Bottom 0.254: v40.05,12.81 39.08,12.81 38.58,13.31 34.77,13.31 30.42,17.67 30.42,19.2 29.68,19.94 v29.68,20.62
IO4  (via drill 0.35)
  Top 0.254: v62.89,61.23 62.89,56.22 63.75,55.36 64.23,55.36 64.36,55.23 U3.22 | U5.8 43.23,55.79 v40.83,58.19
  Bottom 0.254: v62.89,61.23 62.89,61.28 61.95,62.22 60,62.22 53.05,55.27 45.88,55.27 42.96,58.19 v40.83,58.19 40.69,58.33 36.88,58.33 34.28,60.93 JP2.1
IO5  (via drill 0.35)
  Top 0.254: v61.78,60.04 62.27,59.55 62.27,56.1 63.39,54.98 63.77,54.98 63.86,54.89 U3.23 | v39.94,57.3 v39.95,57.3 40.96,57.3 43.32,54.94 U5.9
  Bottom 0.254: v61.78,60.04 61.78,60.69 60.89,61.58 59.9,61.58 53.21,54.89 44.47,54.89 42.05,57.3 v39.94,57.3 39.72,57.52 34.22,57.52 JP2.2
IO6  (via drill 0.35)
  Top 0.254: v60.49,60.47 60.98,59.98 60.98,59.47 61.88,58.57 61.88,55.64 U3.24 | U5.10 43.05,54.09 40.8,56.34 v40.8,56.39
  Bottom 0.254: 60.28,60.57 60.38,60.47 v60.49,60.47 59.32,60.47 53.37,54.51 43.5,54.51 41.62,56.39 v40.8,56.39 39.05,56.39 38.3,57.14 31,57.14 JP2.3
IO7  (via drill 0.35)
  Top 0.254: U3.1 62.7,53.5 61.08,55.12 v61.08,58.22 | U5.11 42.98,53.24 41.08,55.14 40.82,55.14 v40.81,55.13
  Bottom 0.254: JP2.4 29.62,54.93 31.48,54.93 33.3,56.76 38.14,56.76 39.77,55.13 v40.81,55.13 41.52,55.13 42.52,54.13 54.12,54.13 59.69,59.7 60.28,59.7 61.04,58.94 61.04,58.26 v61.08,58.22
IO8  (via drill 0.35)
  Top 0.254: U3.2 62.18,52.97 60.44,54.72 60.44,57.68 60.19,57.93 60.19,58.69 v59.98,58.9 | U5.12 42.96,52.39 41.1,54.25 v39.92,54.25
  Bottom 0.254: 59.89,58.99 v59.98,58.9 54.84,53.75 41.53,53.75 41.03,54.25 v39.92,54.25 37.79,56.38 33.71,56.38 31.2,53.86 JP2.5
IO9  (via drill 0.35)
  Top 0.254: U3.3 62.14,52.47 59.68,54.94 v59.68,57.37 | U5.13 42.71,51.54 40.88,53.37 v40.82,53.37
  Bottom 0.254: JP2.6 29.95,52.07 33.87,56 36.93,56 39.56,53.37 40.7,53.37 v40.82,53.37 55.63,53.37 59.64,57.37 v59.68,57.37
IO10  (via drill 0.35)
  Top 0.254: U4.1 46.65,36.95 v46.13,37.47 | U5.14 42.21,50.69 41.94,50.96 v41.94,50.99
  Bottom 0.254: v46.13,37.47 45.55,37.47 44.59,38.43 44.59,48.34 v41.94,50.99 41.24,50.99 39.65,52.58 34.06,52.58 31.72,50.24 24.02,50.24 JP1.1
IO11  (via drill 0.35)
  Top 0.254: v45.24,34.64 46.64,34.64 47,35 U4.4 | 43.71,49.88 U5.15 42.12,49.84 v41.56,49.28 41.48,49.2 41.48,44.51 v41.33,44.36
  Bottom 0.254: 41.33,44.6 v41.33,44.36 41.33,38.67 45.24,34.76 v45.24,34.64 | JP1.3 23.92,44.38 28.67,49.13 31.69,49.13 34.37,51.81 39.03,51.81 v41.56,49.28
IO12  (via drill 0.35)
  Top 0.254: U4.2 46.6,36.3 46.38,36.52 v45.22,36.52 | U5.16 44.81,47.61 44.37,47.17 v43.31,47.17
  Bottom 0.254: JP1.2 23.88,46.92 26.62,49.66 31.68,49.66 34.22,52.2 39.49,52.2 41.65,50.04 41.87,50.04 43.31,48.6 v43.31,47.17 44.21,46.27 44.21,37.53 v45.22,36.52
IO13  (via drill 0.35)
  Top 0.254: U4.3 47.91,35.63 46.16,35.63 v46.15,35.62 | U5.17 45.66,47.15 43.45,44.94 v43.45,44.86
  Bottom 0.254: v46.15,35.62 44.95,35.62 43.45,37.12 v43.45,44.86 42.99,44.86 39.21,48.64 39.21,50.23 38.01,51.43 34.53,51.43 31.44,48.34 29.28,48.34 25.95,45.01 25.95,42.64 25.15,41.84 JP1.4
LO1  (via drill 0.35)
  Top 0.254: v68.06,53.87 68.06,54.13 69.97,56.03 69.97,56.79 68.95,57.81 68.95,58.3 68.47,58.78 Q15.8 | v65.27,48.66 65.27,49.3 65.4,49.43 65.4,50.24 U3.11
  Bottom 0.254: v68.06,53.87 67.3,53.11 67.3,50.7 v65.27,48.66
LO2  (via drill 0.35)
  Top 0.254: Q16.8 72.68,51.67 74.03,50.32 74.03,48.79 72.63,47.39 68.64,47.39 v67.55,48.48 | v64.25,47.78 64.25,48.76 64.86,49.37 U3.10
  Bottom 0.254: v67.55,48.48 66.85,47.78 v64.25,47.78
LO3
  Top 0.254: Q17.8 77.36,45.79 77.67,45.79 78.22,45.24 78.22,44.35 79.11,43.46 79.11,42.1 75.59,39.56 72.76,39.56 71.44,40.89 65.83,40.89 61.76,44.95 61.76,46.47 62.91,47.62 62.91,48.07 64.36,49.52 U3.9
N$1
  Top 0.508: R27.2 42.9,8.41 LED3.A
N$2
  Top 0.508: R23.2 38.73,9.78 39.42,9.09 LED4.A
N$3
  Top 0.508: R1.2 44.94,9.31 44.55,8.93 LED1.A
N$4
  Top 0.254: R3.1 52.46,9.87 52.48,9.86 J2.B5
N$5
  Top 0.508: LED4.C | LED1.C | LED1.C LED3.C LED2.C LED4.C | LED4.C | S3.1 33.19,11.62 33.19,10.3 34.92,8.57 34.92,7.51 36.2,6.23 LED4.C
N$6
  Top 0.508: LED2.A 40.96,8.46 40.96,9.73 R28.2
N$7
  Top 0.508: U1.3 50.34,18.55 R19.2 52.28,17.98 R21.2
N$8
  Top 0.508: U1.4 47.64,21.47 C1.1
N$9
  Top 0.254: R24B.2 37.88,24.99 R24A.1
N$10
  Top 0.508: C3.1 C2.1 41.97,21.35 42.7,20.63 42.7,19.32 43.47,18.55 U1.6
N$11
  Top 0.61: C2.2 42.56,23.1 R22.2
N$30
  Top 0.508: C4.2 50.05,15.13 49.29,15.89 U1.1
N$35
  Top 0.508: R19.1 52.25,14.87 50.32,16.8 49.75,16.8 U1.2
  Top 0.813: 57.31,18.16 D10.C 57.04,17.89 57.04,15.5 56.43,14.89 55.47,14.89 C16.1 C15.1 52.31,14.88 R19.1
N$80
  Top 0.254: J2.A5 49.48,9.68 R4.2
PH
  Top 0.508: C4.1 48.3,15.03 47.32,16 U1.8 45.16,16 D9.C
  Top 0.813: U1.8 42.32,16
  Top 1.27: 42.32,16 41.43,16.89 L2.1
RXD0  (via drill 0.35)
  Top 0.254: U5.40 56.99,57.49 56.7,57.2 56.09,56.59 v56.09,52.17
  Bottom 0.254: v56.09,52.17 56.09,45.57 64.13,37.53 64.13,29.75 59.31,24.93 57.93,23.55 48.58,23.55 41.09,16.06 35.33,16.06 32.62,18.77 32.62,20.08 32.62,20.24 25.41,27.45 JP4.1
TXD0  (via drill 0.35)
  Top 0.254: U5.39 58.63,56.64 59.05,56.22 59.21,56.06 59.21,47.24 59.21,42.42 63.99,37.64 63.99,32.8 | 63.99,32.8 63.99,32.64 | 63.99,32.8 63.99,31.16 57.98,25.15 54.52,21.69 50.12,21.69 v49.21,22.6
  Bottom 0.254: JP4.2 23.39,24.81 27,24.81 32.24,19.57 32.24,18.61 35.17,15.68 42.29,15.68 v49.21,22.6
VB1
  Top 0.254: D1.C 66.04,62.22 C6.1 65.56,60.73 63.27,58.44 63.27,56.44 63.96,55.74 64.38,55.74 65.36,54.77 U3.20
VB2
  Top 0.254: 70.03,54.93 D3.C 70.11,54.85 C7.1 69.84,52.97 U3.17
VB3
  Top 0.254: C8.1 74.93,48.88 D4.C 72.99,47.01 67.95,47.01 66.8,48.17 66.8,49.49 67.22,49.91 67.22,51.17 66.92,51.47 U3.14
VBUS  (via drill 0.35)
  Top 0.254: 53.08,8.73 J2.B4_A9 53.13,8.85 53.93,9.66 | v48.35,9.91 48.33,9.89 J2.A4_B9 | R27.1 42.9,12.68 v44.19,13.97
  Top 0.508: 54.32,10.04 v54.19,9.91 53.93,9.66
  Top 0.813: v35.08,14.08 34.91,14.25 D5.A
  Bottom 0.254: v48.35,9.91 v54.19,9.91
  Bottom 0.813: v48.35,9.91 46.34,11.92 46.19,11.92 45.31,12.8 45.31,13.77 45.11,13.97 v44.19,13.97 35.19,13.97 v35.08,14.08
VCC  (via drill 0.35)
  Top 0.254: D1.A 67.36,62.39 66.92,61.95 66.92,60.09 66.03,59.21 Q15.9 | D3.A 72.02,54.76 71.36,54.76 71.01,54.41 71.01,52.59 70.22,51.8 Q16.9 | D4.A 76.19,48.92 75.81,48.54 75.81,46.51 75.18,45.87 Q17.9 | U3.4 61.26,51.97 C5.2 | 50.6,13.46 50.21,13.07 46.39,13.07 45.33,14.13 45.33,14.44 44.66,15.11 43.72,15.11 42.18,13.57 39.74,13.57 38.78,12.62 R23.1
  Top 0.508: D10.A 59.45,18.29 58.7,17.54 58.7,15.76 56.59,13.65 50.79,13.65 50.6,13.46
  Top 1.016: C5.2 61.25,51.71 60.06,51.71 v59.98,51.63
  Top 1.27: D10.A 60.45,18.29 69.06,26.9 76.31,26.9 80.13,23.08 VCC.1
  Bottom 0.508: 60.14,52.89 60.44,53.19 | 61.4,54.15 60.44,53.19 | 60.44,53.19 60.44,52.09 v59.98,51.63
  Bottom 0.813: v68.71,50.88 69.45,50.88 69.49,50.84
  Bottom 2.54: VCC.1 80.13,22.65 72.97,29.81 72.97,44.32 v73.65,45 69.49,45 | 69.49,45 62.72,45 60.14,47.58 60.14,52.89 | v64.44,57.97 64.44,57.19 61.4,54.15 | 69.49,45 69.49,50.84
  other vias: 64.43,56.9 68.7,49.84 73.63,43.92
  pour Top (no thermals): 64.32,56.66 65.06,56.66 65.12,56.71 65.16,56.73 66.1,56.73 66.1,58.17 64.28,58.17 64.22,58.12 64.22,56.75
  pour Top (no thermals): 68.59,49.59 70.31,49.59 70.31,51.07 68.55,51.07 68.47,51 68.47,49.7
  pour Top (no thermals): 73.39,43.65 75.29,43.65 75.3,45.23 73.38,45.23 73.38,43.65
  pour Top (no thermals): 75.64,25.61 73.12,23.09 73.07,23.07 73,23.07 62.64,12.71 64.59,10.79 76.47,22.67 76.52,22.69 76.57,22.69 76.61,22.67 79.4,19.89 80.86,19.89 81.92,20.95 81.92,22.54 78.84,25.61
VS1
  Top 0.254: Q15.10 67.23,56.27 66.41,55.46 66.41,53.6 U3.18
  pour Top (no thermals): 67.39,59.61 67.38,59.57 66.92,59.12 66.92,56.68 67.55,56.69 67.55,59.07 67.57,59.11 67.87,59.41 67.91,59.43 69.19,59.43 69.24,59.41 71.22,57.43 72.73,57.43 73.77,58.46 73.77,59.95 72.58,61.13 67.39,61.13
VS2
  Top 0.254: Q16.10 71.49,50.77 71.49,49.08 68.03,49.08 67.74,49.38 67.74,51.3 67.08,51.96 66.67,51.96 66.66,51.97 U3.15 | 71.49,52.87 C7.2
  pour Top (no thermals): 71.45,52.44 71.44,52.4 71.08,52.05 71.08,49.55 71.69,49.55 71.69,51.88 71.71,51.92 72,52.21 72.04,52.23 73.03,52.23 73.08,52.21 73.19,52.1 77.69,52.1 78.73,53.13 78.73,54.61 77.68,55.65 76.22,55.65 74.55,53.98 74.5,53.96 71.45,53.96
VS3
  Top 0.254: 76.37,46.95 C8.2 | Q17.10 76.37,43.08 68.8,43.08 66.03,45.84 66.03,48.98 65.86,49.15 U3.12
  pour Top (no thermals): 76.3,46.39 76.29,46.35 76.03,46.1 76.03,43.71 76.69,43.71 76.69,46.2 76.71,46.24 76.9,46.43 76.94,46.45 78.64,46.45 78.69,46.43 79.29,45.83 81.32,45.83 82.41,46.91 82.41,48.32 81.32,49.4 79.82,49.4 78.49,48.07 78.44,48.05 76.3,48.05
VSENSE
  Top 0.254: R24B.1 37.86,26.52 39.5,24.88 39.57,24.88 39.33,24.64 | 39.33,24.64 R25.2 39.5,24.46 | 39.21,23.88 39.21,22.69 39.57,22.32 42.2,22.32 42.54,21.98 42.54,21.71 44.35,19.9 U1.5 | 39.21,23.88 39.21,24.21 | 39.21,23.88 39.21,24.52 39.33,24.64

### Text on the board
tPlace: reLoaD Motor | Nicklas Rondot | Dario Mager
tNames: IO4 | IO5 | IO6 | IO7 | IO8 | IO9 | CS | CLK | MOSI | MISO | RX | TX | GND